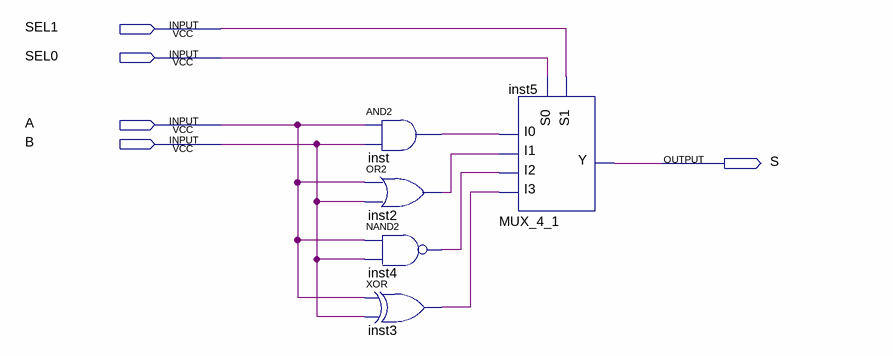
[diagram p0: schematic sheet]
// Quartus schematic LUS.bdf as structural Verilog: 5 symbols, 5 pins
module LUS (
  input  SEL1,
  input  SEL0,
  input  A,
  input  B,
  output S
);

  wire inst2_out, inst3_out, inst4_out, inst_out;

  and inst (inst_out, A, B);
  or inst2 (inst2_out, A, B);
  nand inst4 (inst4_out, A, B);
  xor inst3 (inst3_out, A, B);
  MUX_4_1 inst5 (.S1(SEL1), .S0(SEL0), .I3(inst3_out), .I2(inst4_out), .I1(inst2_out), .I0(inst_out), .Y(S));
endmodule
